# EAGLE design advanced (EAGLE 9.3.0)
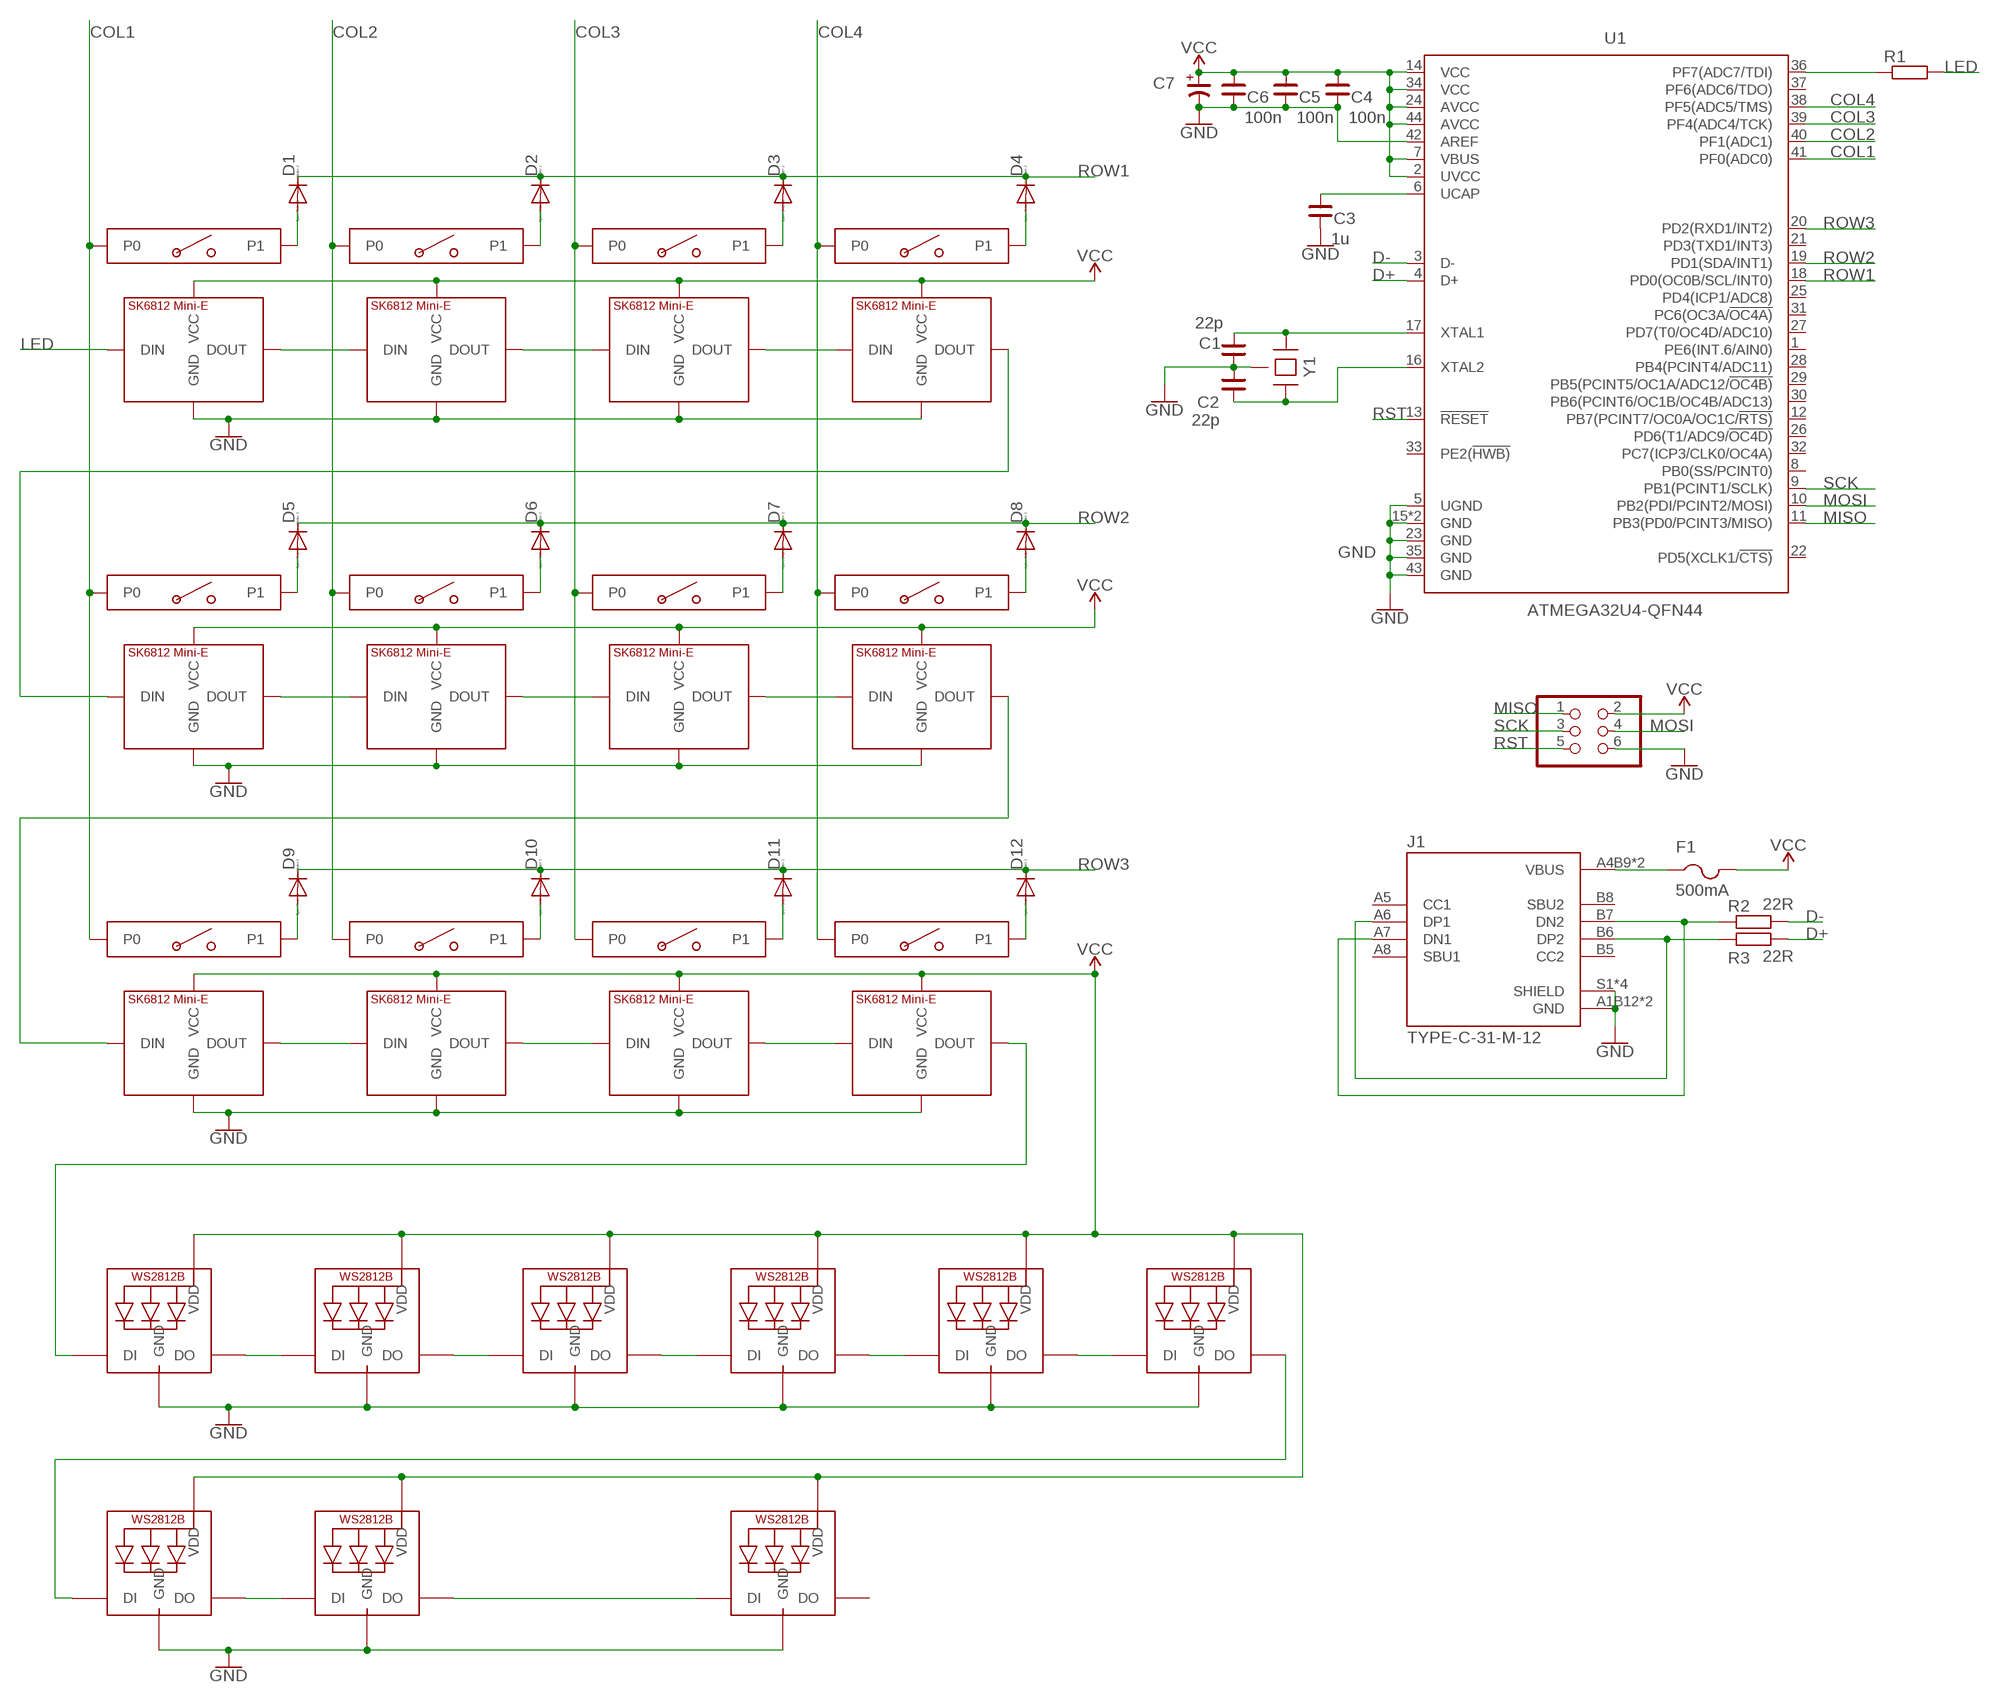
[diagram p0: schematic, sheet 1]

## Parts
C1  22p  CNP-0805  [0805]
C2  22p  CNP-0805  [0805]
C3  1u  CNP-0805  [0805]
C4  100n  CNP-0805  [0805]
C5  100n  CNP-0805  [0805]
C6  100n  CNP-0805  [0805]
C7  10u  CP-3216-18R  [3216-18R/T]
D1  1N4148DIODE_0805  [0805]
D2  1N4148DIODE_0805  [0805]
D3  1N4148DIODE_0805  [0805]
D4  1N4148DIODE_0805  [0805]
D5  1N4148DIODE_0805  [0805]
D6  1N4148DIODE_0805  [0805]
D7  1N4148DIODE_0805  [0805]
D8  1N4148DIODE_0805  [0805]
D9  1N4148DIODE_0805  [0805]
D10  1N4148DIODE_0805  [0805]
D11  1N4148DIODE_0805  [0805]
D12  1N4148DIODE_0805  [0805]
F1  500mA  PTCFUSE-1206  [R1206]
J1  TYPE-C-31-M-12  [HRO_TYPE-C-31-M-12]
JP3  PINHD-2X3  [2X03]
R1  RESISTOR-0805  [R0805]
R2  22R  RESISTOR-0805  [R0805]
R3  22R  RESISTOR-0805  [R0805]
U1  ATMEGA32U4-QFN44  [QFN-44]
U$1  WS2812B-3535  [3535-LED]
U$2  WS2812B-3535  [3535-LED]
U$3  WS2812B-3535  [3535-LED]
U$4  WS2812B-3535  [3535-LED]
U$5  WS2812B-3535  [3535-LED]
U$6  WS2812B-3535  [3535-LED]
U$7  WS2812B-3535  [3535-LED]
U$8  WS2812B-3535  [3535-LED]
U$10  WS2812B-3535  [3535-LED]
U$55  KEYSWITCH-SK6812  [UNIVERSAL_KEYSWITCH_SK6812MINIE]
U$57  KEYSWITCH-SK6812  [UNIVERSAL_KEYSWITCH_SK6812MINIE]
U$59  KEYSWITCH-SK6812  [UNIVERSAL_KEYSWITCH_SK6812MINIE]
U$61  KEYSWITCH-SK6812  [UNIVERSAL_KEYSWITCH_SK6812MINIE]
U$73  KEYSWITCH-SK6812  [UNIVERSAL_KEYSWITCH_SK6812MINIE]
U$75  KEYSWITCH-SK6812  [UNIVERSAL_KEYSWITCH_SK6812MINIE]
U$77  KEYSWITCH-SK6812  [UNIVERSAL_KEYSWITCH_SK6812MINIE]
U$79  KEYSWITCH-SK6812  [UNIVERSAL_KEYSWITCH_SK6812MINIE]
U$91  KEYSWITCH-SK6812  [UNIVERSAL_KEYSWITCH_SK6812MINIE]
U$93  KEYSWITCH-SK6812  [UNIVERSAL_KEYSWITCH_SK6812MINIE]
U$95  KEYSWITCH-SK6812  [UNIVERSAL_KEYSWITCH_SK6812MINIE]
U$97  KEYSWITCH-SK6812  [UNIVERSAL_KEYSWITCH_SK6812MINIE]
Y1  CRYSTAL-4PIN-3.2X2.5  [CRYSTAL-3.2X2.5]

## Nets
COL1: U1.41(PF0(ADC0)) U$55.ALPS1(P0) U$55.CHOC1(P0) U$55.MX1(P0) U$73.ALPS1(P0) U$73.CHOC1(P0) U$73.MX1(P0) U$91.ALPS1(P0) U$91.CHOC1(P0) U$91.MX1(P0)
COL2: U1.40(PF1(ADC1)) U$57.ALPS1(P0) U$57.CHOC1(P0) U$57.MX1(P0) U$75.ALPS1(P0) U$75.CHOC1(P0) U$75.MX1(P0) U$93.ALPS1(P0) U$93.CHOC1(P0) U$93.MX1(P0)
COL3: U1.39(PF4(ADC4/TCK)) U$59.ALPS1(P0) U$59.CHOC1(P0) U$59.MX1(P0) U$77.ALPS1(P0) U$77.CHOC1(P0) U$77.MX1(P0) U$95.ALPS1(P0) U$95.CHOC1(P0) U$95.MX1(P0)
COL4: U1.38(PF5(ADC5/TMS)) U$61.ALPS1(P0) U$61.CHOC1(P0) U$61.MX1(P0) U$79.ALPS1(P0) U$79.CHOC1(P0) U$79.MX1(P0) U$97.ALPS1(P0) U$97.CHOC1(P0) U$97.MX1(P0)
D+: R3.2 U1.4(D+)
D-: R2.2 U1.3(D-)
GND: C1.1 C2.2 C3.2 C4.2 C5.2 C6.2 C7.- J1.A1B12(GND) J1.B1A12(GND) J1.S1(SHIELD) J1.S2(SHIELD) J1.S3(SHIELD) J1.S4(SHIELD) JP3.6 U1.5(UGND) U1.15(GND) U1.23(GND) U1.35(GND) U1.42(AREF) U1.43(GND) U1.TAB(GND) U$1.GND U$2.GND U$3.GND U$4.GND U$5.GND U$6.GND U$7.GND U$8.GND U$10.GND U$55.GND U$57.GND U$59.GND U$61.GND U$73.GND U$75.GND U$77.GND U$79.GND U$91.GND U$93.GND U$95.GND U$97.GND Y1.2(GND) Y1.4(GND)
LED: R1.2 U$91.DIN
MISO: JP3.1 U1.11(PB3(PD0/PCINT3/MISO))
MOSI: JP3.4 U1.10(PB2(PDI/PCINT2/MOSI))
N$1: U$1.P$4(DO) U$2.P$3(DI)
N$2: U$2.P$4(DO) U$3.P$3(DI)
N$3: U$3.P$4(DO) U$4.P$3(DI)
N$4: U$4.P$4(DO) U$5.P$3(DI)
N$5: U$5.P$4(DO) U$6.P$3(DI)
N$8: U$7.P$4(DO) U$8.P$3(DI)
N$9: U$8.P$4(DO) U$10.P$3(DI)
N$15: U$6.P$4(DO) U$7.P$3(DI)
N$16: U$1.P$3(DI) U$61.DOUT
N$18: C1.2 U1.17(XTAL1) Y1.1
N$19: F1.1 J1.A4B9(VBUS) J1.B4A9(VBUS)
N$20: R1.1 U1.36(PF7(ADC7/TDI))
N$38: J1.A6(DP1) J1.B6(DP2) R3.1
N$39: C2.1 U1.16(XTAL2) Y1.3
N$40: J1.A7(DN1) J1.B7(DN2) R2.1
N$58: C3.1 U1.6(UCAP)
N$63: D9.1(A) U$55.ALPS2(P1) U$55.CHOC2(P1) U$55.MX2(P1)
N$64: D10.1(A) U$57.ALPS2(P1) U$57.CHOC2(P1) U$57.MX2(P1)
N$65: D11.1(A) U$59.ALPS2(P1) U$59.CHOC2(P1) U$59.MX2(P1)
N$66: D12.1(A) U$61.ALPS2(P1) U$61.CHOC2(P1) U$61.MX2(P1)
N$72: U$55.DOUT U$57.DIN
N$73: U$57.DOUT U$59.DIN
N$74: U$59.DOUT U$61.DIN
N$83: D5.1(A) U$73.ALPS2(P1) U$73.CHOC2(P1) U$73.MX2(P1)
N$84: D6.1(A) U$75.ALPS2(P1) U$75.CHOC2(P1) U$75.MX2(P1)
N$85: D7.1(A) U$77.ALPS2(P1) U$77.CHOC2(P1) U$77.MX2(P1)
N$86: D8.1(A) U$79.ALPS2(P1) U$79.CHOC2(P1) U$79.MX2(P1)
N$92: U$73.DOUT U$75.DIN
N$93: U$75.DOUT U$77.DIN
N$94: U$77.DOUT U$79.DIN
N$103: D1.1(A) U$91.ALPS2(P1) U$91.CHOC2(P1) U$91.MX2(P1)
N$104: D2.1(A) U$93.ALPS2(P1) U$93.CHOC2(P1) U$93.MX2(P1)
N$105: D3.1(A) U$95.ALPS2(P1) U$95.CHOC2(P1) U$95.MX2(P1)
N$106: D4.1(A) U$97.ALPS2(P1) U$97.CHOC2(P1) U$97.MX2(P1)
N$112: U$91.DOUT U$93.DIN
N$113: U$93.DOUT U$95.DIN
N$114: U$95.DOUT U$97.DIN
N$123: U$55.DIN U$79.DOUT
N$124: U$73.DIN U$97.DOUT
ROW1: D1.2(C) D2.2(C) D3.2(C) D4.2(C) U1.18(PD0(OC0B/SCL/INT0))
ROW2: D5.2(C) D6.2(C) D7.2(C) D8.2(C) U1.19(PD1(SDA/INT1))
ROW3: D9.2(C) D10.2(C) D11.2(C) D12.2(C) U1.20(PD2(RXD1/INT2))
RST: JP3.5 U1.13(!RESET)
SCK: JP3.3 U1.9(PB1(PCINT1/SCLK))
VCC: C4.1 C5.1 C6.1 C7.+ F1.2 JP3.2 U1.2(UVCC) U1.7(VBUS) U1.14(VCC) U1.24(AVCC) U1.34(VCC) U1.44(AVCC) U$1.VDD U$2.VDD U$3.VDD U$4.VDD U$5.VDD U$6.VDD U$7.VDD U$8.VDD U$10.VDD U$55.VCC U$57.VCC U$59.VCC U$61.VCC U$73.VCC U$75.VCC U$77.VCC U$79.VCC U$91.VCC U$93.VCC U$95.VCC U$97.VCC
Unconnected: J1.A5(CC1) J1.A8(SBU1) J1.B5(CC2) J1.B8(SBU2) U1.1(PE6(INT.6/AIN0)) U1.8(PB0(SS/PCINT0)) U1.12(PB7(PCINT7/OC0A/OC1C/!RTS)) U1.21(PD3(TXD1/INT3)) U1.22(PD5(XCLK1/!CTS)) U1.25(PD4(ICP1/ADC8)) U1.26(PD6(T1/ADC9/!OC4D)) U1.27(PD7(T0/OC4D/ADC10)) U1.28(PB4(PCINT4/ADC11)) U1.29(PB5(PCINT5/OC1A/ADC12/!OC4B)) U1.30(PB6(PCINT6/OC1B/OC4B/ADC13)) U1.31(PC6(OC3A/!OC4A)) U1.32(PC7(ICP3/CLK0/OC4A)) U1.33(PE2(!HWB)) U1.37(PF6(ADC6/TDO)) U$10.P$4(DO)

## Library data of the parts
C1-C6 = cap-master:CNP-: NON-POLARIZED CAP
C7 = cap-master:CP-: POLARIZED CAP
D1-D12 = DIYKeyboard:1N4148
F1 = adafruit:PTCFUSE: PTC fuses, resettable thermistors
J1 = TYPE-C-31-M-12:TYPE-C-31-M-12: USB Connectors 24 Receptacle 1 8.94*7.3mm RoHS Check availability <https://pricing.snapeda.com/parts/TYPE-C-31-M-12/HRO%20Electronics%20Co.%2C%20Ltd./view-part?ref=eda>; AVAILABILITY: Not in stock; DESCRIPTION: USB Connectors 24 Receptacle 1 8.94*7.3mm RoHS; MF: HRO Electronics Co., Ltd.; MP: TYPE-C-31-M-12; PACKAGE: Package; PRICE: None
JP3 = pinhead:PINHD-2X3: PIN HEADER
R1-R3 = Controller:RESISTOR
U1 = MCU:ATMEGA32U4
U$1-U$8 U$10 = DIYKeyboard:WS2812B-3535
U$55 U$57 U$59 U$61 U$73 U$75 U$77 U$79 U$91 U$93 U$95 U$97 = DIYKeyboard:KEYSWITCH-SK6812
Y1 = Components:CRYSTAL-4PIN

## Board
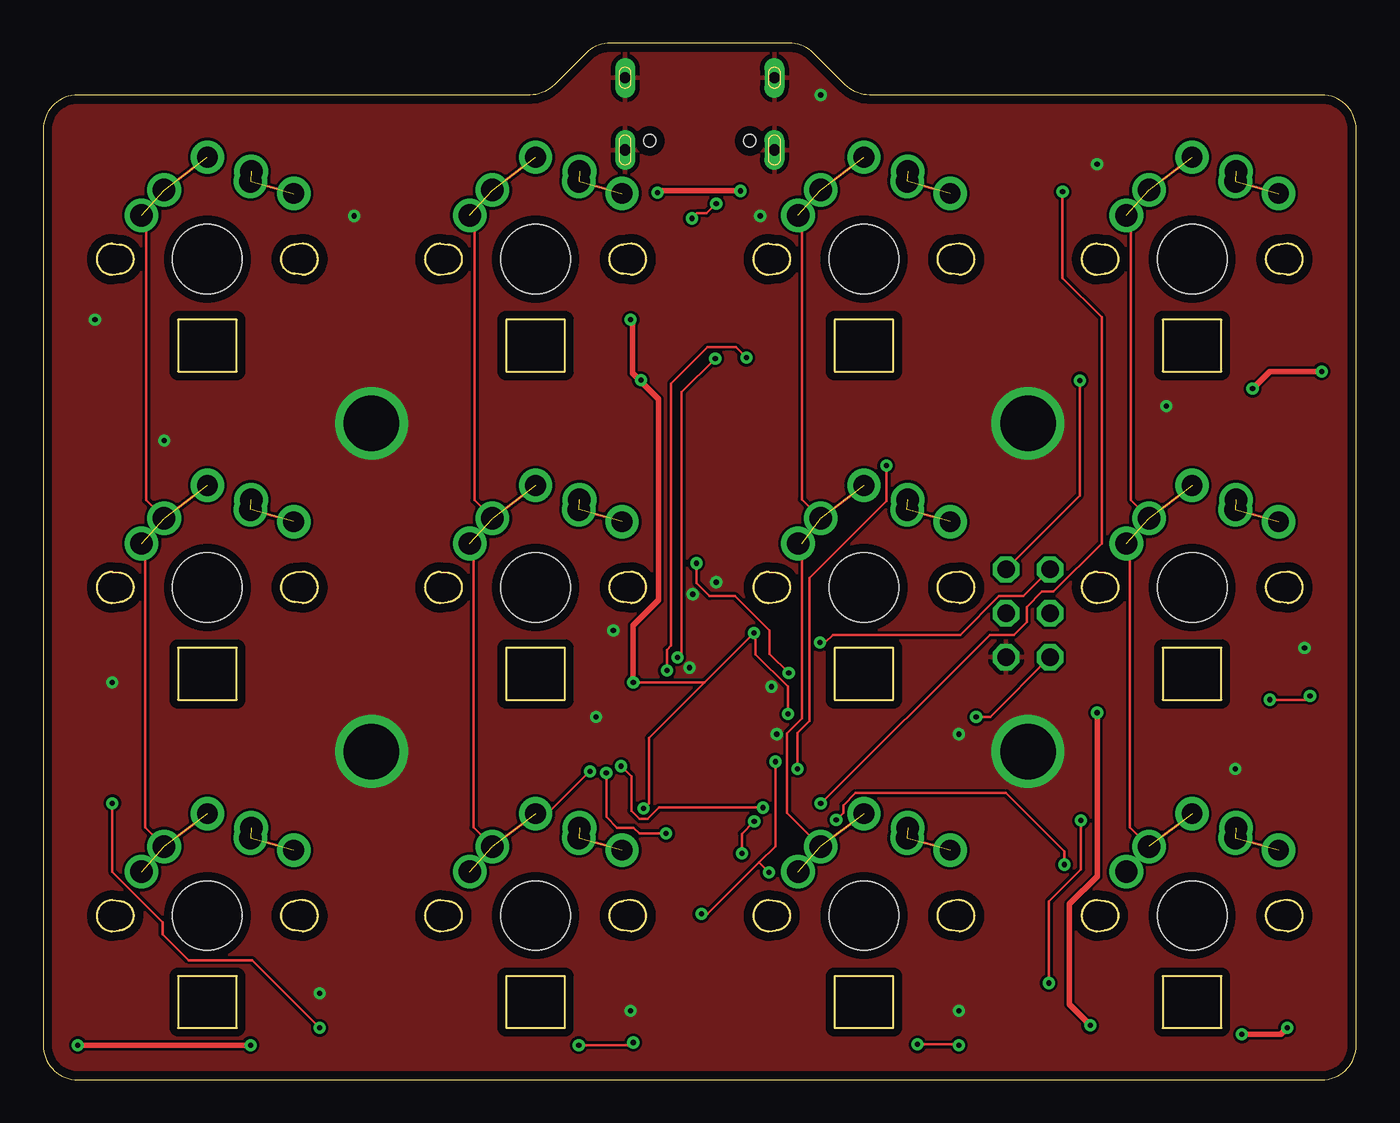
[diagram p1: board, top side]
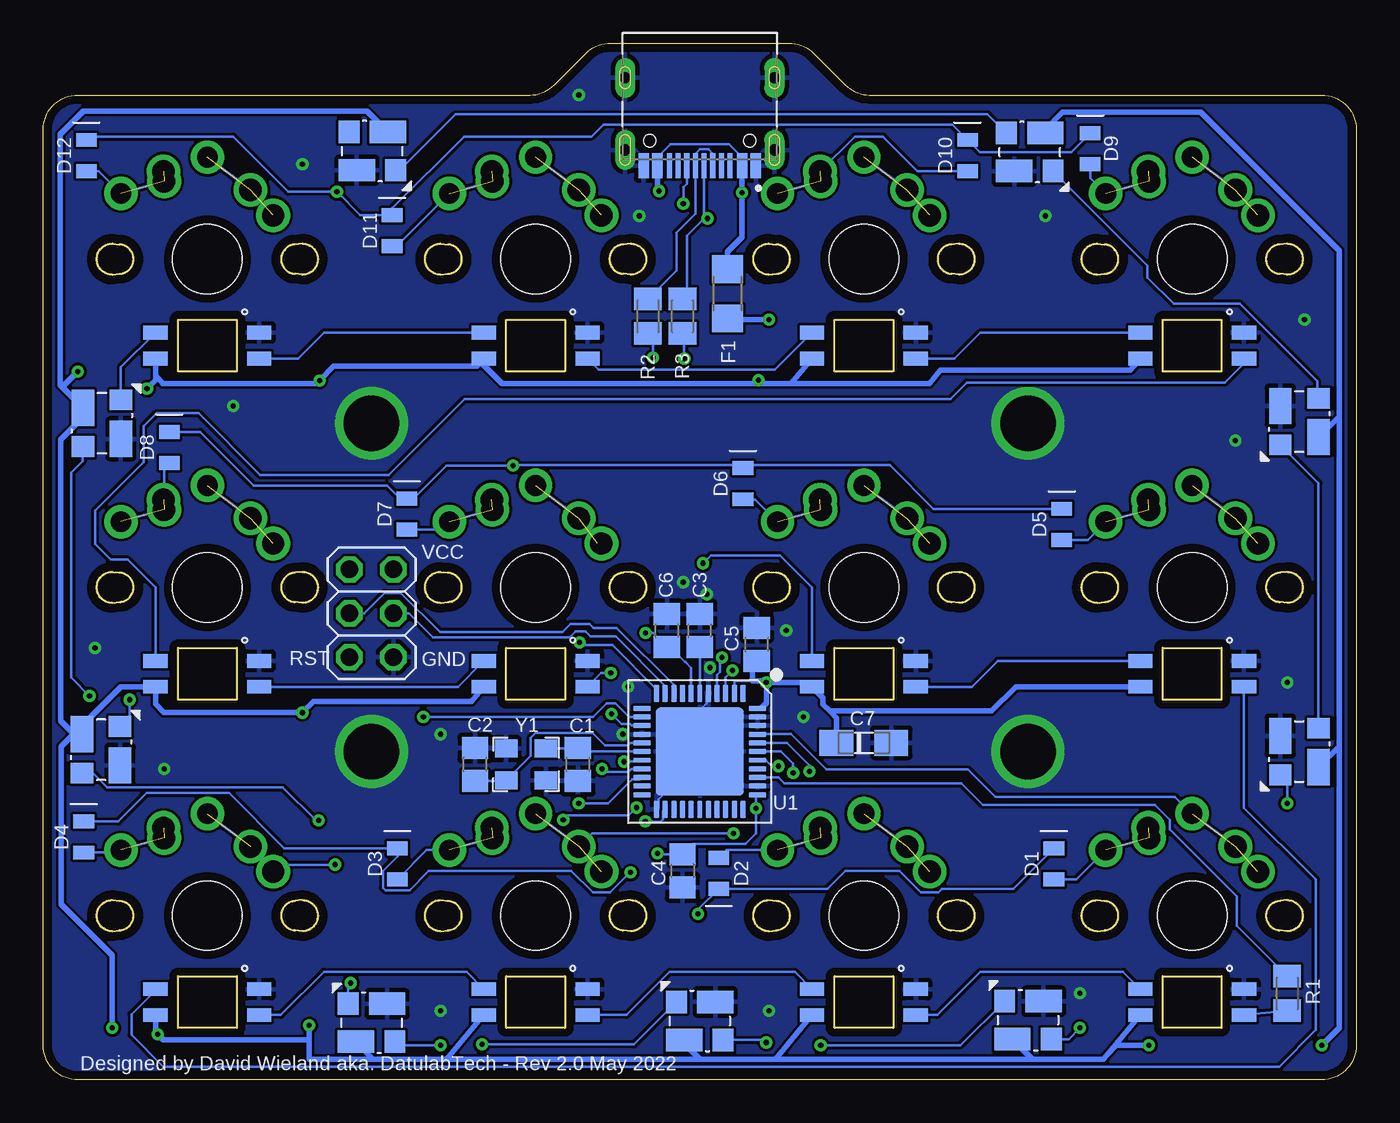
[diagram p2: board, bottom side, seen from below]

Size 76 x 60 mm. Coordinates in mm from the lower left corner, seen from the top.
Outline: 28.17,57 2,57 arc90 0,55 0,2 arc90 2,0 74,0 arc90 76,2 76,55 arc90 74,57 47.83,57 arc-45 46.41,57.59 44.59,59.41 arc45 43.17,60 32.83,60 arc45 31.41,59.41 29.59,57.59 arc-45 28.17,57
Copper layers (1*16): Top 0.035mm / dielectric 1.5mm / Bottom 0.035mm
Design rules "default *": minimum track width 6mil, minimum drill 0.3mm, track to track 6mil, track to pad 6mil, pad to pad 6mil, via to via 6mil, smd to smd 6mil, copper to edge 20mil, drill to drill 6mil, minimum pad ring 10mil, minimum via ring 8mil, stop-mask expansion 4mil, vias tented up to drill 0.5mm, thermal gap 10mil

### Footprints (pad centres in the part's own frame; a part is rotated, then mirrored left to right if it is on the bottom)
0805 = smd 1.27 x 1.524: 1 -0.953,0; 2 0.953,0
3216-18R/T = smd 1.95 x 1.5: + 1.587,0; - -1.587,0
0805' = smd 0.8 x 1.2: 1 -0.9,0; 2 0.9,0
R1206 = smd 1.6 x 1.803: 1 -1.422,0; 2 1.422,0
HRO_TYPE-C-31-M-12 = smd 0.6 x 1.45: A1B12 -3.25,5.095; A4B9 -2.45,5.095; B1A12 3.25,5.095; B4A9 2.45,5.095 | smd 0.3 x 1.45: A5 -1.25,5.095; A6 -0.25,5.095; A7 0.25,5.095; A8 1.25,5.095; B5 1.75,5.095; B6 0.75,5.095; B7 -0.75,5.095; B8 -1.75,5.095 | drill 0.65 pad 1.05 long: S1 -4.32,4.18; S2 4.32,4.18; S3 -4.32,0; S4 4.32,0 | hole 0.7: -2.89,3.65; 2.89,3.65
2X03 = drill 1.016 octagon: 1 -2.54,-1.27; 2 -2.54,1.27; 3 0,-1.27; 4 0,1.27; 5 2.54,-1.27; 6 2.54,1.27
R0805 = smd 1.3 x 1.6: 1 -1,0; 2 1,0
QFN-44 = smd 1 x 0.3: 1 -3.35,2.5; 2 -3.35,2; 3 -3.35,1.5; 4 -3.35,1; 5 -3.35,0.5; 6 -3.35,0; 7 -3.35,-0.5; 8 -3.35,-1; 9 -3.35,-1.5; 10 -3.35,-2; 11 -3.35,-2.5; 23 3.35,-2.5; 24 3.35,-2; 25 3.35,-1.5; 26 3.35,-1; 27 3.35,-0.5; 28 3.35,0; 29 3.35,0.5; 30 3.35,1; 31 3.35,1.5; 32 3.35,2; 33 3.35,2.5 | smd 0.3 x 1: 12 -2.5,-3.35; 13 -2,-3.35; 14 -1.5,-3.35; 15 -1,-3.35; 16 -0.5,-3.35; 17 0,-3.35; 18 0.5,-3.35; 19 1,-3.35; 20 1.5,-3.35; 21 2,-3.35; 22 2.5,-3.35; 34 2.5,3.35; 35 2,3.35; 36 1.5,3.35; 37 1,3.35; 38 0.5,3.35; 39 0,3.35; 40 -0.5,3.35; 41 -1,3.35; 42 -1.5,3.35; 43 -2,3.35; 44 -2.5,3.35 | smd 5.08 x 5.08: TAB 0,0
3535-LED = smd 2.1 x 1.3: GND 2.65,2.85; VDD 0.85,0.65 | smd 1.2 x 1.3: P$3 0.4,2.85; P$4 3.1,0.65
UNIVERSAL_KEYSWITCH_SK6812MINIE = drill 1.3 pad 1.93: ALPS1 -2.5,4; ALPS2 2.5,4.5; MX1 -3.81,2.54; MX2 2.54,5.08 | drill 1.2 pad 1.93: CHOC1 0,5.9; CHOC2 5,3.8 | smd 1.4 x 0.8 bottom: DIN -3,-5.75; DOUT 3,-4.25; GND -3,-4.25; VCC 3,-5.75 | hole 4: 0,0
CRYSTAL-3.2X2.5 = smd 1.3 x 1.05: 1 -1.15,-0.925; 2 1.15,-0.925; 3 1.15,0.925; 4 -1.15,0.925

### Placement (x,y rotation side)
C1  45.05,18.25 90 bottom
C2  51,18.25 90 bottom
C3  38,26 90 bottom
C4  39,12.1 270 bottom
C5  34.7,25.2 90 bottom
C6  39.9,26 90 bottom
C7  28.5,19.5 180 bottom
D1  1N4148DIODE_0805  [0805']  17.5,12.5 90 bottom
D2  1N4148DIODE_0805  [0805']  36.9,11.95 270 bottom
D3  1N4148DIODE_0805  [0805']  55.5,12.5 90 bottom
D4  1N4148DIODE_0805  [0805']  73.65,14.05 90 bottom
D5  1N4148DIODE_0805  [0805']  17.05,32.15 90 bottom
D6  1N4148DIODE_0805  [0805']  35.5,34.5 90 bottom
D7  1N4148DIODE_0805  [0805']  54.95,32.75 90 bottom
D8  1N4148DIODE_0805  [0805']  68.7,36.6 90 bottom
D9  1N4148DIODE_0805  [0805']  15.4,53.9 90 bottom
D10  1N4148DIODE_0805  [0805']  22.5,53.5 90 bottom
D11  1N4148DIODE_0805  [0805']  55.8,49.15 90 bottom
D12  1N4148DIODE_0805  [0805']  73.5,53.5 90 bottom
F1  36.4,45.5 270 bottom
J1  38,58 180 bottom
JP3  57,27 270 bottom
R1  4,5 270 bottom
R2  41,44.2 270 bottom
R3  39,44.2 270 bottom
U1  38,19 270 bottom
U$1  74.35,39.75 270 bottom
U$2  74.4,20.85 270 bottom
U$3  58.75,1.55 0 bottom
U$4  39.75,1.65 0 bottom
U$5  20.75,1.7 0 bottom
U$6  1.55,17.25 90 bottom
U$7  1.55,36.35 90 bottom
U$8  17.15,55.45 180 bottom
U$10  55.2,55.5 180 bottom
U$55  9.5,47.5 0 top
U$57  28.5,47.5 0 top
U$59  47.5,47.5 0 top
U$61  66.5,47.5 0 top
U$73  9.5,28.5 0 top
U$75  28.5,28.5 0 top
U$77  47.5,28.5 0 top
U$79  66.5,28.5 0 top
U$91  9.5,9.5 0 top
U$93  28.5,9.5 0 top
U$95  47.5,9.5 0 top
U$97  66.5,9.5 0 top
Y1  48.05,18.25 180 bottom

### Tracks (layer width: path | path; a pad name or v marks a point on that pad's centre or on a via)
COL1  (6 unrouted)
  Top 0.152: U$91.ALPS1 5.9,14.6 5.9,30.83 U$73.MX1 | U$73.ALPS1 5.95,33.55 5.95,49.78 U$55.MX1
  Bottom 0.152: U$91.CHOC1 9.53,15.4 10.5,16.37 20.89,16.37 22.47,17.95 30.65,17.95 32.73,20.03 34.62,20.03 U1.41
COL2  (via drill 0.3)  (6 unrouted)
  Top 0.152: U$93.ALPS1 24.9,14.6 24.9,30.83 U$75.MX1 | U$75.ALPS1 24.95,33.55 24.95,49.78 U$57.MX1 | v31.64,17.86 31.61,17.86 29.16,15.4 U$93.CHOC1
  Bottom 0.152: v31.64,17.86 31.64,18.19 32.95,19.5 U1.40
COL3  (via drill 0.3)  (6 unrouted)
  Top 0.152: U$77.ALPS1 43.9,33.6 43.9,49.83 U$59.MX1 | U$95.ALPS1 43.04,15.46 43.04,20.04 43.9,20.91 43.9,31.04 U$77.MX1 | v36.05,14.26 34.5,14.26 34.17,14.59 33.22,14.59 32.59,15.22 v32.59,17.76
  Bottom 0.152: U$95.ALPS1 44.24,14.26 v36.05,14.26 | v32.59,17.76 32.59,18.31 33.29,19 U1.39
COL4  (via drill 0.3)  (5 unrouted)
  Top 0.152: U$97.ALPS1 62.9,14.6 62.9,30.83 U$79.MX1 | U$79.ALPS1 62.95,33.55 62.95,49.78 U$61.MX1 | v33.45,18.16 34.04,17.57 34.04,15.57 34.52,15.09 34.98,15.09 35.64,15.75 v41.65,15.75 | v45.9,15.05 46.31,15.46 46.31,15.89 47.01,16.59 55.73,16.59 59.1,13.22 v59.1,12.45
  Bottom 0.152: U1.38 34.63,18.48 34.18,18.48 33.85,18.16 v33.45,18.16 | 62.75,12.25 U$97.ALPS1 | v41.65,15.75 42.11,15.29 45.66,15.29 v45.9,15.05 | 62.75,12.25 62.55,12.45 v59.1,12.45 | U$97.MX1 62.69,12.19 62.75,12.25
D+  (via drill 0.3)
  Top 0.152: v38.9,41.75 36.95,39.8 36.95,24.69 v36.71,24.45
  Bottom 0.152: R3.2 38.9,43.1 v38.9,41.75 | U1.4 37,23.43 36.82,23.61 36.82,24.34 v36.71,24.45
D-  (via drill 0.3)
  Top 0.152: v40.7,41.8 40.09,42.41 38.45,42.41 36.35,40.31 36.35,25.14 36.1,24.89 v36.1,23.68
  Bottom 0.152: R2.2 40.7,42.9 v40.7,41.8 | v36.1,23.68 36.5,23.29 U1.3
GND  (via drill 0.3, 3.2)
  Bottom 0.152: U1.5 37.62,22.23 37.62,21.78 38,21.4 U1.TAB 40,17 40,16.6 40.38,16.22 40.38,15.77 U1.23
  other vias: 33,26 38.95,28.8 42.45,20 37.4,23.85 41.5,50 32,21 42.15,22.75 18,50 7,37 4,23 16,5 34,4 53,4 69,18 65,39 61,53 45,57 73,25 19,38 19,19 57,38 57,19 53,20 3,44 37.6,28.1
  pour Bottom: 0,65 0,0 76,0 76,65
  pour Top: 0,65 0,0 76,0 76,65
LED
  Bottom 0.152: R1.2 U$91.DIN
MISO  (via drill 0.3)
  Top 0.152: v44.95,25.31 45.26,25.31 45.7,25.75 53.08,25.75 55.32,27.99 56.72,27.99 JP3.1
  Bottom 0.152: U1.11 40.5,22.6 43.06,25.16 44.8,25.16 v44.95,25.31
MOSI
  Bottom 0.152: U1.10 40,22.8 42.85,25.65 44.32,25.65 44.61,25.94 45.19,25.94 45.53,25.6 53.43,25.6 54.83,27 JP3.4
N$1  (via drill 0.3)
  Top 0.152: v73.32,22.22 73.1,22 v71,22
  Bottom 0.152: U$1.P$4 73.7,35.82 74.38,35.15 74.38,23.28 v73.32,22.22 | v71,22 71,21 U$2.P$3
N$2  (via drill 0.3)
  Top 0.152: v58.2,5.6 v58.21,5.61 58.21,10.33 60.06,12.19 v60.06,15.01
  Bottom 0.152: U$2.P$4 73.12,17.75 72.3,16.92 62.13,16.92 60.21,15.01 v60.06,15.01 | v58.2,5.6 58.35,5.45 U$3.P$3
N$3  (via drill 0.3)
  Top 0.152: v50.6,2.05 52.95,2.05 v53,2
  Bottom 0.152: U$4.P$3 41.8,2.05 v50.6,2.05 | v53,2 55.45,2 U$3.P$4
N$4  (via drill 0.3)
  Top 0.152: v34.15,2.15 34,2 v31,2
  Bottom 0.152: U$4.P$4 34.3,2.3 v34.15,2.15 | v31,2 22.9,2 U$5.P$3
N$5  (via drill 0.3)
  Top 0.152: v16,3 12.08,6.92 8.43,6.92 6.92,8.43 6.92,9.11 4,12.03 v4,16
  Bottom 0.152: U$5.P$4 16.65,2.35 v16,3 | v4,16 4,17.25 U$6.P$3
N$8
  Bottom 0.152: U$7.P$4 2.27,39.52 2.27,40.45 6.74,44.92 10.57,44.92 12.08,46.43 12.08,47.13 U$8.P$3
N$9
  Bottom 0.152: U$8.P$4 21.34,55.89 52.13,55.89 55.37,52.65 U$10.P$3
N$15
  Bottom 0.152: U$6.P$4 2.2,34.55 U$7.P$3
N$16
  Bottom 0.152: U$61.DOUT 71.5,41.25 U$1.P$3
N$18
  Bottom 0.152: Y1.1 45.08,19.18 | 45.08,19.18 C1.2 | 45.08,19.18 44.9,19 U1.17
N$19  (via drill 0.3)
  Top 0.305: v40.35,51.45 35.65,51.45 v35.55,51.35
  Bottom 0.152: J1.B4A9 40.43,52.93 40.43,53.42 39.69,54.16 36.31,54.16 35.52,53.38 35.52,52.93 J1.A4B9
  Bottom 0.305: J1.A4B9 v35.55,51.35 35.55,48.77 36.4,47.92 F1.1 | J1.B4A9 40.45,51.55 v40.35,51.45
N$20
  Bottom 0.152: R1.1 6.92,8.92 6.92,10.62 10.8,14.5 10.8,15.04 11.67,15.92 21.61,15.92 22.85,17.15 33.1,17.15 33.45,17.5 U1.36
N$38  (via drill 0.3)
  Top 0.152: v38.95,50.71 38.4,50.16 37.85,50.16 v37.55,49.86
  Bottom 0.152: J1.A6 37.75,49.86 | R3.1 38.75,45.45 38.75,48.86 37.75,49.86 | J1.B6 38.75,51.88 38.95,51.67 v38.95,50.71 | v37.55,49.86 37.75,49.86
N$39
  Bottom 0.152: C2.1 49.23,17.3 Y1.3 47.78,18.75 47.78,19.8 47.51,20.07 44.19,20.07 43.48,19.35 42.15,19.35 42,19.5 U1.16
N$40
  Bottom 0.152: R2.1 39.35,46.84 39.35,49.03 38.25,50.14 J1.A7 38.28,52.93 38.28,53.58 37.99,53.86 37.51,53.86 37.25,53.6 J1.B7
N$58
  Bottom 0.152: U1.6 C3.1
N$63  (2 unrouted)
  Bottom 0.152: U$55.CHOC2 15.4,52.2 D9.1
N$64  (2 unrouted)
  Bottom 0.152: D10.1 25.4,52.6 27.39,54.59 29.03,54.59 U$57.MX2
N$65  (2 unrouted)
  Bottom 0.152: D11.1 55.55,48.25 U$59.CHOC2
N$66  (2 unrouted)
  Bottom 0.152: U$61.CHOC2 72.8,52.6 D12.1
N$72
  Bottom 0.152: U$55.DOUT 21.75,43.25 23.25,41.75 U$57.DIN
N$73
  Bottom 0.152: U$57.DOUT 33.65,41.1 43.85,41.1 U$59.DIN
N$74
  Bottom 0.152: U$59.DOUT 59.75,43.25 61.25,41.75 U$61.DIN
N$83  (2 unrouted)
  Bottom 0.152: D5.1 15.55,31.25 U$73.CHOC2
N$84  (2 unrouted)
  Bottom 0.152: U$75.CHOC2 34.8,33.6 D6.1
N$85  (2 unrouted)
  Bottom 0.152: D7.1 52.95,31.85 U$77.CHOC2
N$86  (2 unrouted)
  Bottom 0.152: D8.1 69,35.4 U$79.ALPS2
N$92
  Bottom 0.152: U$73.DOUT 20.75,24.25 22.25,22.75 U$75.DIN
N$93  (via drill 0.3)
  Top 0.152: v43.15,23.55 42.05,24.66 42.05,25.99 40.04,27.99 38.57,27.99 37.81,28.76 v37.81,29.9
  Bottom 0.152: U$77.DIN 43.7,23.55 v43.15,23.55 | U$75.DOUT 31.5,28.5 33.35,30.35 37.36,30.35 v37.81,29.9
N$94
  Bottom 0.152: U$79.DIN 52,22.75 U$77.DOUT
N$103  (2 unrouted)
  Bottom 0.152: D1.1 16.2,11.6 U$91.CHOC2
N$104  (2 unrouted)
  Bottom 0.152: U$93.CHOC2 36.45,13.3 D2.1
N$105  (2 unrouted)
  Bottom 0.152: D3.1 53.8,13.3 U$95.CHOC2
N$106  (2 unrouted)
  Bottom 0.152: D4.1 71.65,13.15 U$97.CHOC2
N$112
  Bottom 0.152: U$91.DOUT 13.5,6.25 21.75,6.25 24.25,3.75 U$93.DIN
N$113
  Bottom 0.152: U$93.DOUT 32.5,6.25 39.75,6.25 42.25,3.75 U$95.DIN
N$114
  Bottom 0.152: U$95.DOUT 51.5,6.25 59.75,6.25 62.25,3.75 U$97.DIN
N$123
  Bottom 0.152: U$55.DIN 6.36,41.61 7.62,40.36 22.55,40.36 23.5,39.4 51.6,39.4 56,35 63.43,35 67.01,38.58 69.44,38.58 70.18,37.84 70.18,35.76 73,32.94 73,31 72.1,30.1 71.12,30.1 69.5,28.49 U$79.DOUT
N$124
  Bottom 0.152: U$97.DOUT 69.5,5.17 70.88,3.79 70.88,2.59 69.05,0.76 4.47,0.76 2.34,2.88 2.34,11.59 6.5,15.75 U$73.DIN
ROW1  (via drill 0.3)
  Top 0.152: v42.38,18.42 42.38,13.52 41.43,12.57 | 41.43,12.57 38.46,9.6 v38.1,9.6 | v42,12 41.43,12.57
  Bottom 0.152: D4.2 71.65,14.95 70.01,16.59 65.24,16.59 62.05,13.4 D3.2 55.5,12.92 56.33,12.1 56.33,11.11 56.2,10.97 54.8,10.97 53.69,12.08 45.44,12.08 44.19,10.84 43.19,10.84 42.03,12 v42,12 | U1.18 41.43,18.42 v42.38,18.42 | D1.2 19.85,11.05 23.98,11.05 24.19,10.84 25.19,10.84 26.44,12.08 29.57,12.08 30.61,11.05 D2.2 38.1,9.85 v38.1,9.6
ROW2  (via drill 0.3)
  Top 0.152: v48.8,35.55 48.8,33.5 44.34,29.05 44.34,20.76 43.66,20.08 v43.66,18
  Bottom 0.152: D8.2 66.91,37.49 63.81,34.4 56.1,34.4 55.35,33.65 D7.2 54.55,33.65 52.65,35.55 v48.8,35.55 48.76,35.59 35.69,35.59 D6.2 35.31,35.59 27.01,35.59 24.46,33.05 D5.2 | U1.19 41.96,18 42.14,17.81 43.6,17.81 43.66,17.86 v43.66,18
ROW3  (via drill 0.3)
  Top 0.152: v59,51.4 59,46.4 61.26,44.14 61.26,31.03 58.48,28.25 57.81,28.25 56.92,27.36 56.92,26.49 56.19,25.76 54.79,25.76 45.03,16 v45,16
  Bottom 0.152: D12.2 73.31,54.59 65.01,54.59 61.81,51.4 v59,51.4 57.65,50.05 D11.2 55.8,50.44 51.64,54.59 44.27,54.59 43.58,55.28 23.38,55.28 D10.2 21.8,53.7 16.5,53.7 D9.2 | U1.20 41.47,17.38 41.92,17.38 43.3,16.01 v44.99,16.01 v45,16
RST  (via drill 0.3)
  Top 0.152: v54,21 54.81,21 JP3.5
  Bottom 0.152: v54,21 44.16,21 43.39,21.77 42.88,21.77 42.1,21 U1.13
SCK
  Bottom 0.152: U1.9 39.5,22.85 42.81,26.16 44.15,26.16 44.38,26.39 45.47,26.39 45.95,25.91 53.04,25.91 55.32,28.19 56.24,28.19 57.43,27 JP3.3
VCC  (via drill 0.3)
  Top 0.152: v43.11,21.17 43.11,22.76 41.24,24.63 41.24,25.76 v41.14,25.86 38.28,23 | v41.15,14.96 40.44,14.24 v40.44,13.1 | 38.28,23 v34.15,23 | 38.28,23 35.06,19.78 35.06,16.01 v34.75,15.7 | JP3.2 60,33.81 v60,40.48
  Top 0.305: v34,44 34.1,43.9 34.1,40.91 34.51,40.5 | v34.15,23 34.15,26.29 35.62,27.76 35.62,39.39 34.51,40.5 | v60.6,3.15 59.39,4.36 59.39,10.18 61,11.79 v61,21.25 | v72,3 71.62,2.62 v69.38,2.62 | v2,2 v12,2 | v70,40 71,41 v74,41 | v34.6,40.5 34.51,40.5
  Bottom 0.152: C5.1 34.95,24 | U1.2 35.98,22.37 35.98,23 35.9,23.08 34.95,23.08 | U1.44 34.45,21.5 | U1.7 38.5,23.85 38.84,24.18 38.86,24.18 39.72,25.05 C6.1 40.72,25.86 v41.14,25.86 | U1.14 41.95,20.5 42.05,20.6 42.54,20.6 v43.11,21.17 | U1.34 34.75,16.4 v34.75,15.7 34.75,14.25 35.35,13.65 38.4,13.65 C4.1 40.39,13.05 v40.44,13.1 | U1.24 40.12,15.53 40.12,15.08 40.28,14.92 40.72,14.92 40.76,14.96 v41.15,14.96 | v34.15,23 34.15,23.08 | v60,40.48 60,40.3
  Bottom 0.305: 34.95,24 34.95,23.08 34.15,23.08 | 34.45,21.5 34.15,21.8 v34.15,23 31.75,23 U$75.VCC 30.86,22.11 30.86,21.73 30.47,21.34 | F1.2 arc-45 36.21,44 v34,44 | 60.6,2.3 69.05,2.3 v69.38,2.62 69.5,2.75 U$97.VCC | 56.9,1.2 60.6,1.2 60.6,2.3 | 56.9,1.2 52.64,1.2 | 52.64,1.2 38,1.2 | 38,1.2 33.62,1.2 | 18.75,1.2 14.64,1.2 14.47,1.4 | 14.47,1.4 U$91.VCC | U$95.VCC 52.64,1.2 | U$93.VCC 33.62,1.2 | U$77.VCC 51.21,21.9 60.35,21.9 v61,21.25 69.04,21.25 69.02,21.27 69.5,21.75 U$79.VCC 71.5,22.75 74.12,20.12 | 60,40.3 69.09,40.3 69.07,40.32 69.5,40.75 | v60,40.48 59.18,41.3 50.88,41.3 U$59.VCC 50.67,41.58 50.67,41.54 49.43,40.3 34.7,40.3 | 34.7,40.3 32.72,40.3 | 32.72,40.3 24.72,40.3 24.08,41.06 13.08,41.06 U$55.VCC | U$61.VCC 69.5,40.75 | U$57.VCC 32.72,40.3 | 60.6,2.3 v60.6,3.15 | 30.47,21.34 30.09,20.95 C7.+ | U$73.VCC 19.71,22.75 21.12,21.34 30.47,21.34 | v72,3 72,7.21 74.95,10.17 74.95,19.3 74.25,20 | 74.25,20 74.12,20.12 | U$7.VDD 1,38.4 | U$8.VDD 18,55 17,56 9,56 1,48 1,38.4 | U$6.VDD 1,19.3 | 1,19.3 1,38.4 | 1,19.3 1,3 v2,2 | v12,2 13.87,2 14.47,1.4 | U$5.VDD 18.75,1.2 | U$4.VDD 38.9,2.1 38,1.2 | U$3.VDD 56.9,1.2 | U$2.VDD 74.25,20 | 74.12,20.12 74.34,20.12 74.98,20.76 74.98,37.05 73.7,38.33 U$1.VDD 74.9,40.1 | 74.9,40.1 75,40.2 75,54.73 73.68,56.05 57.26,56.05 U$10.VDD | 69.5,40.75 69.5,40.5 v70,40 | v74,41 74.9,40.1 | 33.62,1.2 18.75,1.2 | v34.6,40.5 34.6,40.4 34.7,40.3

### Text on the board
bNames: VCC | GND | RST | Designed by David Wieland aka. DatulabTech - Rev 2.0 May 2022